# Altium schematic sheet Encoder.SchDoc
size 259 x 167 mm; SheetNumber: 6; SheetTotal: 7
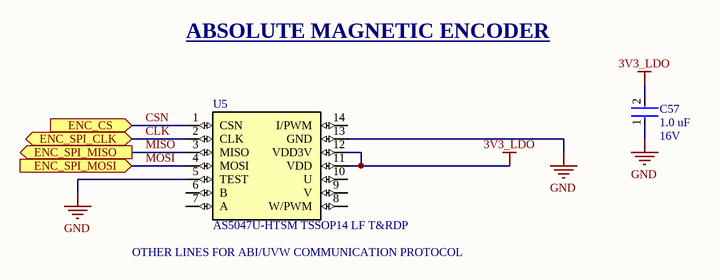
[diagram p0: Encoder.SchDoc]

## Parts
C57  Capacitance: 1.0 uF  Voltage: 16V  [CAP-0603]  (hidden comment: CC0603KRX7R7BB105)
U5  AS5047U-HTSM TSSOP14 LF T&RDP  [SOP65P640X110-14N]

## Ports
ENC_CS (in, see MCU[4B]), ENC_SPI_CLK (bidir, see Connectors[1D], MCU[4B]), ENC_SPI_MISO (out, see Connectors[2D], MCU[1C]), ENC_SPI_MOSI (in, see Connectors[2D], MCU[1C])

## Nets
3V3_LDO: C57.2 U5.11(VDD) U5.12(VDD3V)
GND: C57.1 U5.5(TEST) U5.13(GND)
CLK: U5.2(CLK) ; port ENC_SPI_CLK
CSN: U5.1(CSN) ; port ENC_CS
MISO: U5.3(MISO) ; port ENC_SPI_MISO
MOSI: U5.4(MOSI) ; port ENC_SPI_MOSI

Not connected (* = marked no-connect by the designer): U5 6(B) 7(A) 8(W/PWM) 9(V) 10(U) 14(I/PWM)

## Notes on the sheet
- ABSOLUTE MAGNETIC ENCODER
- (near U5) OTHER LINES FOR ABI/UVW COMMUNICATION PROTOCOL

## Library data of the parts
C57 = CAP-1U-0002: CAP CER 1UF 16V X7R 0603; Device Class: Ceramic; Size: 0603
U5 = IC-ABSENC-0001: Hall Effect Sensor Rotary Position External Magnet, Not Included Gull Wing